# Altium schematic sheet Four Decade BCD Counter.SchDoc
size B; Organization: Altium Limited; Address1: L3, 12a Rodborough Rd; Address2: Frenchs Forest; Address3: NSW; Address4: Australia 2086; DocumentNumber: 2; SheetNumber: 2; SheetTotal: 4
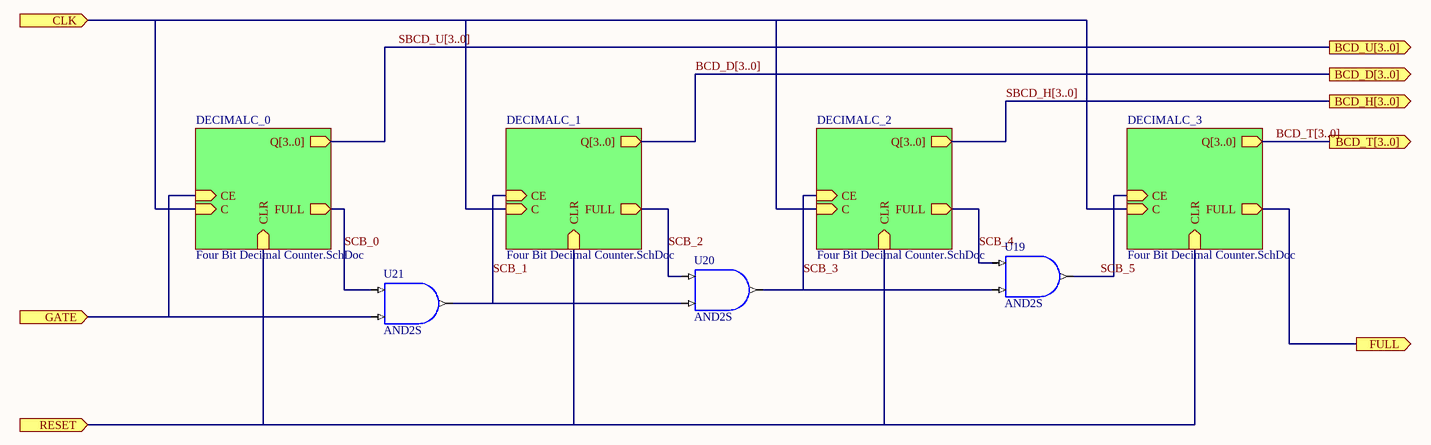
[diagram p0: Four Decade BCD Counter.SchDoc]

## Parts
U19  AND2S
U20  AND2S
U21  AND2S

## Sub-sheets
DECIMALC_0 = Four Bit Decimal Counter.SchDoc: CLR (in), CE (in), C (in), Q[3..0] (out), FULL (out)
DECIMALC_1 = Four Bit Decimal Counter.SchDoc: CLR (in), CE (in), C (in), Q[3..0] (out), FULL (out)
DECIMALC_2 = Four Bit Decimal Counter.SchDoc: CLR (in), CE (in), C (in), Q[3..0] (out), FULL (out)
DECIMALC_3 = Four Bit Decimal Counter.SchDoc: CLR (in), CE (in), C (in), Q[3..0] (out), FULL (out)

## Ports
BCD_D[3..0] (out), BCD_H[3..0] (out), BCD_T[3..0] (out), BCD_U[3..0] (out), CLK (in), FULL (out), GATE (in), RESET (in)

## Nets
CLK: port CLK, sheet DECIMALC_0/C, sheet DECIMALC_1/C, sheet DECIMALC_2/C, sheet DECIMALC_3/C
FULL: port FULL, sheet DECIMALC_3/FULL
GATE: U21.I1 ; port GATE, sheet DECIMALC_0/CE
RESET: port RESET, sheet DECIMALC_0/CLR, sheet DECIMALC_1/CLR, sheet DECIMALC_2/CLR, sheet DECIMALC_3/CLR
SCB_0: U21.I0 ; sheet DECIMALC_0/FULL
SCB_1: U20.I1 U21.O ; sheet DECIMALC_1/CE
SCB_2: U20.I0 ; sheet DECIMALC_1/FULL
SCB_3: U19.I1 U20.O ; sheet DECIMALC_2/CE
SCB_4: U19.I0 ; sheet DECIMALC_2/FULL
SCB_5: U19.O ; sheet DECIMALC_3/CE

## Buses and harness runs
bus BCD_D[3..0] = port BCD_D[3..0] = sheet DECIMALC_1/Q[3..0]
bus BCD_T[3..0] = port BCD_T[3..0] = sheet DECIMALC_3/Q[3..0]
bus SBCD_H[3..0] = port BCD_H[3..0] = sheet DECIMALC_2/Q[3..0]
bus SBCD_U[3..0] = port BCD_U[3..0] = sheet DECIMALC_0/Q[3..0]

## Notes on the sheet
- Title
- Size:
- Date:
- B
- Number:
- Time:
- Revision:
- Sheet
- of
- File:

## Library data of the parts
U19-U21 = AND2S: 2-Input AND Gate, Single Pin Version; Xilinx Equivalent: AND2; ArchiveName: GENERIC; VHDLIB_SIM: GENERIC_LIB; Published: 28-Jan-2004; Publisher: Altium Limited; Core Revision: 1.00.00